# EAGLE design as5040_encoder_1.0 (EAGLE 7.3.0)
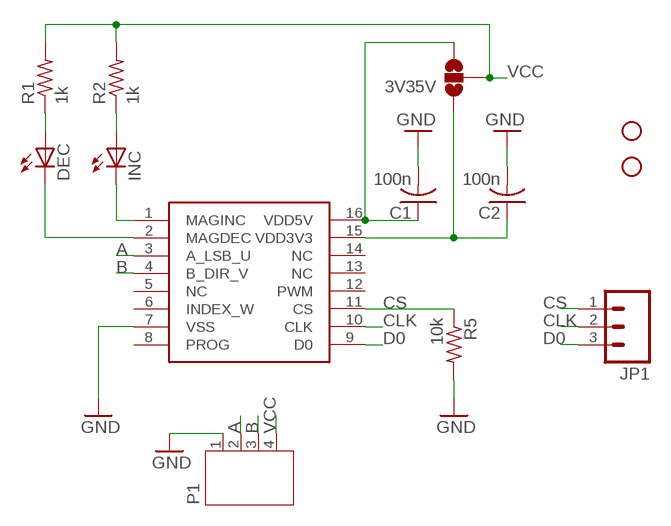
[diagram p0: schematic, sheet 1]

## Parts
3V35V  SOLDERJUMPER_2WAYPASTE1&2&3  [SJ_3_PASTE1&2&3]
5040  AS5040  [SSOP16]
C1  100n  C-USC0603K  [C0603K]
C2  100n  C-USC0603K  [C0603K]
DEC  LEDCHIPLED_0603  [CHIPLED_0603]
INC  LEDCHIPLED_0603  [CHIPLED_0603]
JP1  M03PTH  [1X03]
P1  JST-PH4  [JST-PH4]
R1  1k  R-US_R0603  [R0603]
R2  1k  R-US_R0603  [R0603]
R5  10k  R-US_R0603  [R0603]
STANDOFF1  STAND-OFF  [STAND-OFF]
STANDOFF2  STAND-OFF  [STAND-OFF]

## Nets
A: 5040.3(A_LSB_U) P1.2
B: 5040.4(B_DIR_V) P1.3
CLK: 5040.10(CLK) JP1.2
CS: 5040.11(CS) JP1.1 R5.1
D0: 5040.9(D0) JP1.3
GND: 5040.7(VSS) C1.2 C2.2 P1.1 R5.2
N$1: INC.A R2.1
N$2: DEC.A R1.1
N$3: 5040.1(MAGINC) INC.C
N$4: 5040.2(MAGDEC) DEC.C
N$6: 3V35V.3 5040.16(VDD5V) C1.1
N$7: 3V35V.1 5040.15(VDD3V3) C2.1
VCC: 3V35V.2 P1.4 R1.2 R2.2
Unconnected: 5040.5(NC) 5040.6(INDEX_W) 5040.8(PROG) 5040.12(PWM) 5040.13(NC) 5040.14(NC)

## Library data of the parts
3V35V = SparkFun-Retired:SOLDERJUMPER_2WAY: Solder Jumper 2 way solder jumper
5040 = austriamicrosystems:AS5040
C1 C2 = adafruit:C-US: CAPACITOR, American symbol
DEC INC = adafruit:LED: LED OSRAM: - CHIPLED LG R971, LG N971, LY N971, LG Q971, LY Q971, LO R971, LY R971 LH N974, LH R974 LS Q976, LO Q976, LY Q976 LO Q996 - Hyper CHIPLED LW Q18S LB Q993, LB Q99A, LB R99A - SideLED LS A670, LO A670, LY A670, LG A670, LP A670 LB A673, LV A673, LT A673, LW A673 LH A674 LY A675 LS A676, LA A676, LO A676, LY A676, LW A676 LS A679, LY A679, LG A679 - Hyper Micro SIDELED® LS Y876, LA Y876, LO Y876, LY Y876 LT Y87S - SmartLED LW L88C, LW L88S LB L89C, LB L89S, LG L890 LS L89K, LO L89K, LY L89K LS L896, LA L896, LO L896, LY L896 - TOPLED LS T670, LO T670, LY T670, LG T670, LP T670 LSG T670, LSP T670, LSY T670, LOP T670, LYG T670 LG T671, LOG T671, LSG T671 LB T673, LV T673, LT T673, LW T673 LH T674 LS T676, LA T676, LO T676, LY T676, LB T676, LH T676, LSB T676, LW T676 LB T67C, LV T67C, LT T67C, LS T67K, LO T67K, LY T67K, LW E67C LS E67B, LA E67B, LO E67B, LY E67B, LB E67C, LV E67C, LT E67C LW T67C LS T679, LY T679, LG T679 LS T770, LO T770, LY T770, LG T770, LP T770 LB T773, LV T773, LT T773, LW T773 LH T774 LS E675, LA E675, LY E675, LS T675 LS T776, LA T776, LO T776, LY T776, LB T776 LHGB T686 LT T68C, LB T68C - Hyper Mini TOPLED® LB M676 - Mini TOPLED Santana® LG M470 LS M47K, LO M47K, LY M47K Source: http://www.osram.convergy.de/
JP1 = SparkFun-Connectors:M03: Header 3 Standard 3-pin 0.1" header. Use with straight break away headers (SKU : PRT-00116), right angle break away headers (PRT-00553), swiss pins (PRT-00743), machine pins (PRT-00117), and female headers (PRT-00115). Molex polarized connector foot print use with SKU : PRT-08232 with associated crimp pins and housings.
P1 = jst-ph:JST-PH4
R1 R2 R5 = adafruit:R-US_: RESISTOR, American symbol
STANDOFF1 STANDOFF2 = SparkFun-Electromechanical:STAND-OFF: #4 Stand Off This is the mechanical footprint for a #4 phillips button head screw. Use the keepout ring to avoid running the screw head into surrounding components. SKU : PRT-00447

## Board
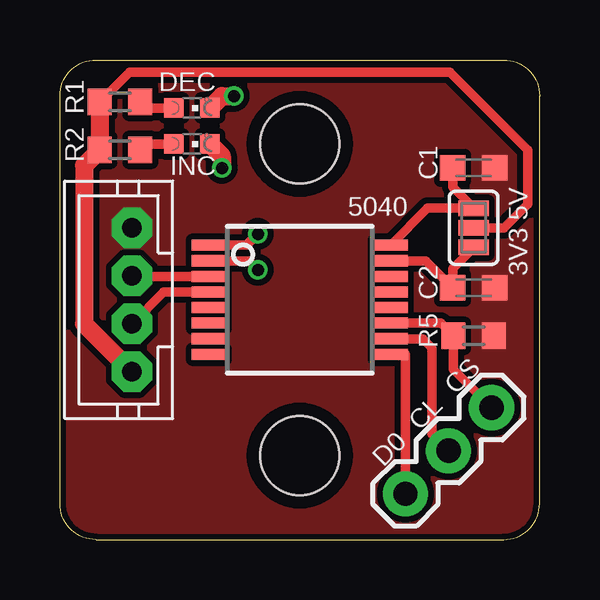
[diagram p1: board, top side]
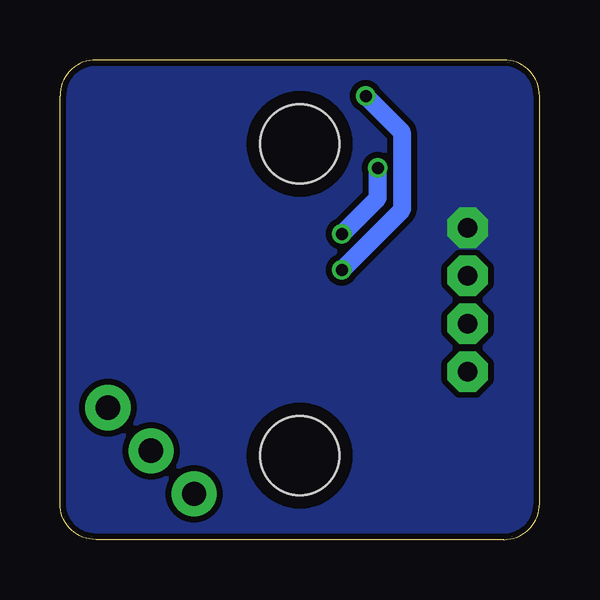
[diagram p2: board, bottom side, seen from below]

Size 20 x 20 mm. Coordinates in mm from the lower left corner, seen from the top.
Outline: 1.5,0 18.5,0 arc90 20,1.5 20,18.5 arc90 18.5,20 1.5,20 arc90 0,18.5 0,1.5 arc90 1.5,0
Copper layers (1*16): Top 0.035mm / dielectric 1.5mm / Bottom 0.035mm
Design rules "ITEADstudio_DRC": minimum track width 6mil, minimum drill 12mil, track to track 6mil, track to pad 6mil, pad to pad 6mil, via to via 6mil, smd to smd 0mil, copper to edge 10mil, drill to drill 10mil, minimum pad ring 10mil, minimum via ring 6mil, stop-mask expansion 2mil, vias tented up to drill 100mil, thermal gap 10mil

### Footprints (pad centres in the part's own frame; a part is rotated, then mirrored left to right if it is on the bottom)
SJ_3_PASTE1&2&3 = smd 0.635 x 1.27: 1 -0.813,0; 2 0,0; 3 0.813,0
SSOP16 = smd 0.46 x 1.43: 1 -2.275,-3.795; 2 -1.625,-3.795; 3 -0.975,-3.795; 4 -0.325,-3.795; 5 0.325,-3.795; 6 0.975,-3.795; 7 1.625,-3.795; 8 2.275,-3.795; 9 2.275,3.795; 10 1.625,3.795; 11 0.975,3.795; 12 0.325,3.795; 13 -0.325,3.795; 14 -0.975,3.795; 15 -1.625,3.795; 16 -2.275,3.795
C0603K = smd 1.05 x 1.08: 1 -0.875,0; 2 0.875,0
CHIPLED_0603 = smd 0.8 x 0.8: A 0,-0.75; C 0,0.75
1X03 = drill 1.016 pad 1.88: 1 0,0; 2 2.54,0; 3 5.08,0
JST-PH4 = drill 0.813 pad 1.676 octagon: 1 3,0; 2 1,0; 3 -1,0; 4 -3,0
R0603 = smd 1 x 1.1: 1 -0.85,0; 2 0.85,0
STAND-OFF = hole 3.302: 0,0

### Placement (x,y rotation side)
3V35V  17.25,13 90 top
5040  10,10 270 top
C1  17.25,15.5 0 top
C2  17.25,10.5 0 top
DEC  5.5,18 270 top
INC  5.5,16.5 270 top
JP1  18,5.5 225 top
P1  3,10 90 top
R1  2.5,18.25 180 top
R2  2.5,16.25 180 top
R5  17.25,8.5 0 top
STANDOFF1  10,3.5 0 top
STANDOFF2  10,16.5 0 top

### Tracks (layer width: path | path; a pad name or v marks a point on that pad's centre or on a via)
A
  Top 0.4: P1.2 3.02,10.97 5040.3
B
  Top 0.4: P1.3 4.33,10.32 5040.4
CLK
  Top 0.25: 15.5,4.41 JP1.2
  Top 0.4: 15.5,4.41 15.5,8 15.12,8.38 5040.10
CS
  Top 0.4: 5040.11 15.88,9.03 R5.1 16.4,7.1 JP1.1
D0
  Top 0.4: JP1.3 14.41,7.72 5040.9
GND
  pour Top (isolate 0.25, rank 6, no thermals): 0,20 0,0 20,0 20,20
  pour Bottom (isolate 0.25, rank 6, no thermals): 0,0 0,20 20,20 20,0
N$1
  Top 0.4: INC.A 3.35,16.5 R2.1
N$2
  Top 0.4: DEC.A 3.35,18 R1.1
N$3  (via drill 0.5)
  Top 0.4: 5040.1 7.78,12.28 v8.25,12.75
  Top 0.75: INC.C 6.75,16 v6.75,15.5
  Bottom 0.75: v8.25,12.75 6.75,14.25 v6.75,15.5
N$4  (via drill 0.5)
  Top 0.4: v8.25,11.25 7.88,11.62 5040.2
  Top 0.75: DEC.C 6.75,18.5 v7.25,18.5
  Bottom 0.75: v7.25,18.5 5.75,17 5.75,13.75 v8.25,11.25
N$6
  Top 0.4: C1.1 16.38,14.69 3V35V.3 15.33,13.81 5040.16
N$7
  Top 0.4: 5040.15 15.25,11.62 C2.1 16.38,11.31 3V35V.1
VCC
  Top 0.4: 3V35V.2 18.5,13 19.5,14 19.5,16.25 16.25,19.5 2.9,19.5 R1.2
  Top 0.75: P1.4 1,9 1,15.6 R2.2 R1.2

### Text on the board
tNames: 3V3 5V | CS | CL | D0